# Altium schematic sheet CD4046-DIP16.SchDoc
size A4
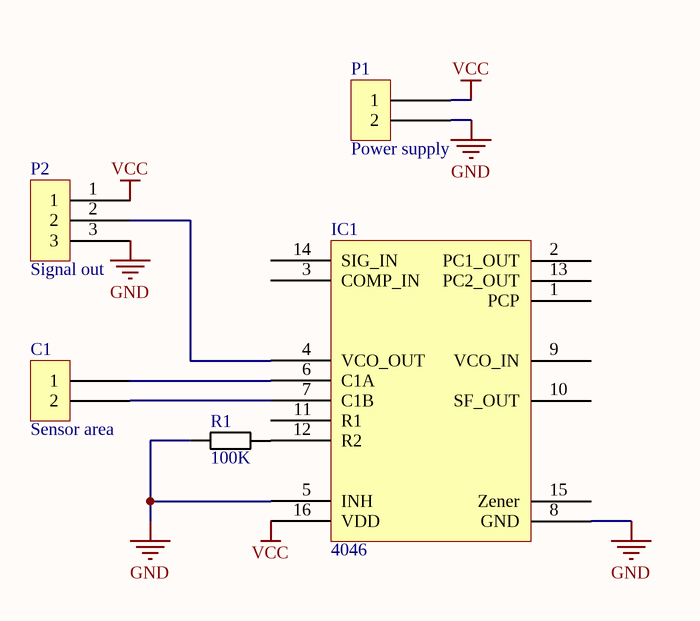
[diagram p0: CD4046-DIP16.SchDoc]

## Parts
C1  Sensor area  [Header 2x1 long]
IC1  4046  [DIP-16]
P1  Power supply  [Header 2x1 long]
P2  Signal out  [Header 3x1 long]
R1  100K  [R 0805 / 2012]

## Nets
GND: IC1.5(INH) IC1.8(GND) P1.2 P2.3 R1.2
VCC: IC1.16(VDD) P1.1 P2.1
NetC1_1: C1.1 IC1.6(C1A)
NetC1_2: C1.2 IC1.7(C1B)
NetIC1_4: IC1.4(VCO_OUT) P2.2
NetIC1_12: IC1.12(R2) R1.1

Not connected (* = marked no-connect by the designer): IC1 1(PCP) 2(PC1_OUT) 3(COMP_IN) 9(VCO_IN) 10(SF_OUT) 11(R1) 13(PC2_OUT) 14(SIG_IN) 15(Zener)

## Library data of the parts
C1 P1 = Header 2x1
IC1 = 4046: PLL / VCO
P2 = Header 1x3: 2.54mm
R1 = Resistor